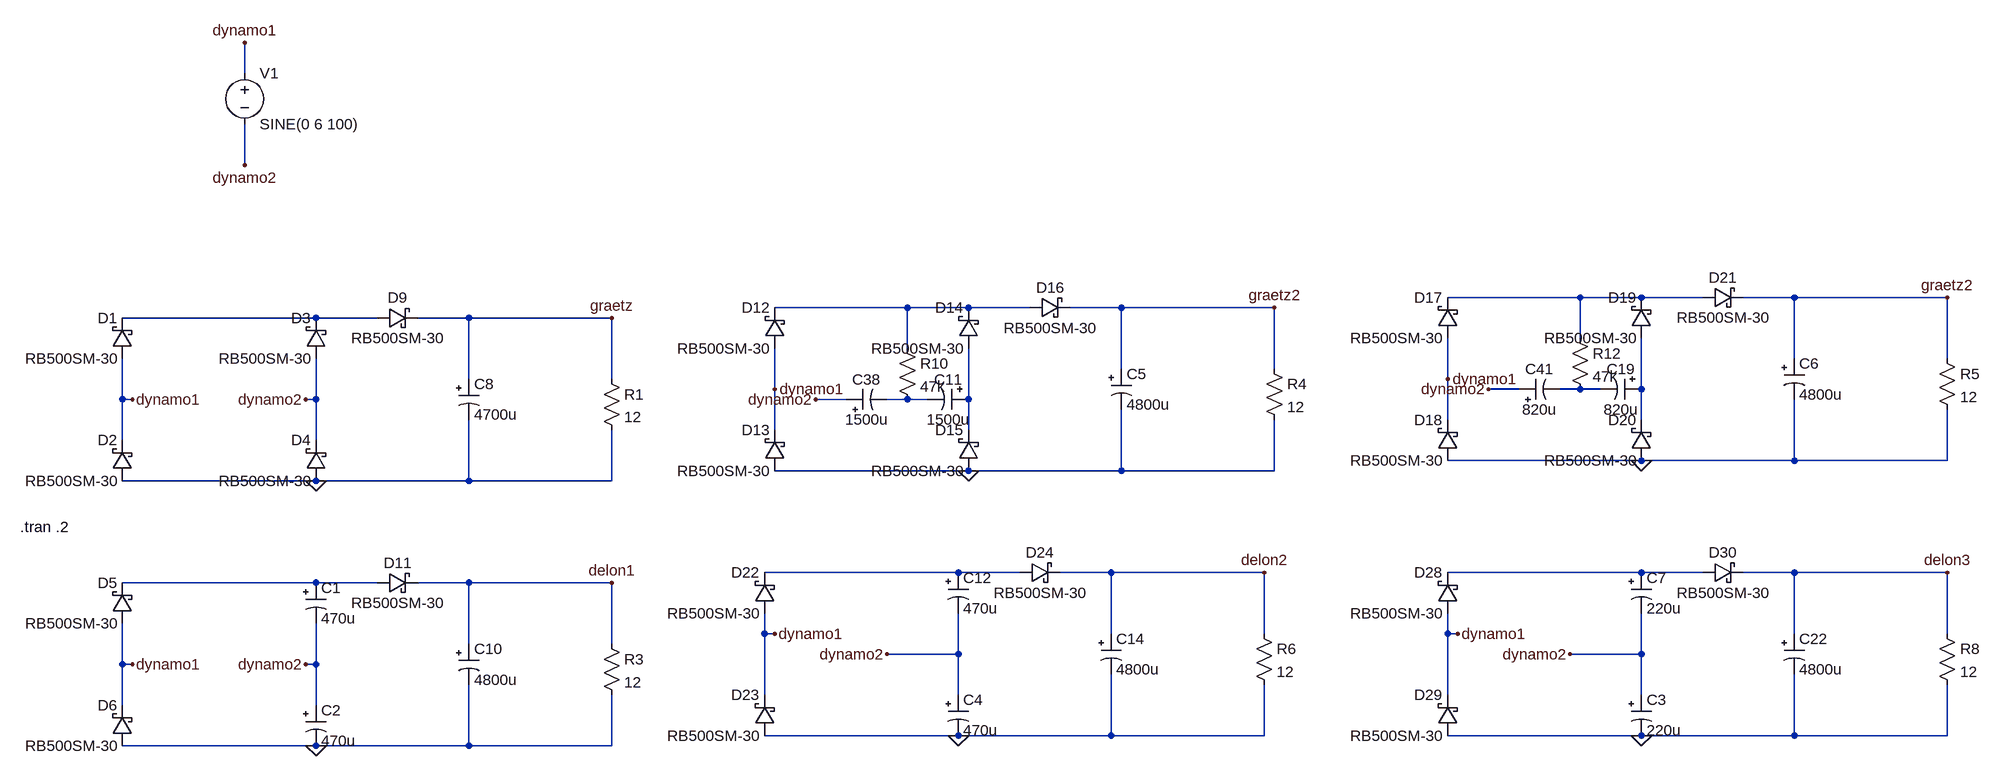
[diagram p0: schematic graetz and delon.asc]
graetz and delon.asc, the LTspice schematic file:
Version 4
SHEET 1 3412 2492
WIRE 304 576 304 528
WIRE 304 720 304 656
WIRE 2400 928 2192 928
WIRE 2496 928 2400 928
WIRE 2592 928 2496 928
WIRE 2736 928 2656 928
WIRE 2976 928 2736 928
WIRE 1344 944 1136 944
WIRE 1440 944 1344 944
WIRE 1536 944 1440 944
WIRE 1680 944 1600 944
WIRE 1920 944 1680 944
WIRE 416 960 112 960
WIRE 512 960 416 960
WIRE 656 960 576 960
WIRE 880 960 656 960
WIRE 2400 992 2400 928
WIRE 1344 1008 1344 944
WIRE 2736 1024 2736 928
WIRE 2976 1024 2976 928
WIRE 1680 1040 1680 944
WIRE 1920 1040 1920 944
WIRE 656 1056 656 960
WIRE 880 1056 880 960
WIRE 2192 1056 2192 992
WIRE 1136 1072 1136 1008
WIRE 2304 1072 2256 1072
WIRE 2400 1072 2368 1072
WIRE 2432 1072 2400 1072
WIRE 2496 1072 2496 992
WIRE 112 1088 112 1024
WIRE 128 1088 112 1088
WIRE 416 1088 416 1024
WIRE 416 1088 400 1088
WIRE 1248 1088 1200 1088
WIRE 1344 1088 1312 1088
WIRE 1376 1088 1344 1088
WIRE 1440 1088 1440 1008
WIRE 2192 1120 2192 1056
WIRE 2496 1120 2496 1072
WIRE 1136 1136 1136 1072
WIRE 1440 1136 1440 1088
WIRE 112 1152 112 1088
WIRE 416 1152 416 1088
WIRE 2496 1184 2192 1184
WIRE 2736 1184 2736 1088
WIRE 2736 1184 2496 1184
WIRE 2976 1184 2976 1104
WIRE 2976 1184 2736 1184
WIRE 1440 1200 1136 1200
WIRE 1680 1200 1680 1104
WIRE 1680 1200 1440 1200
WIRE 1920 1200 1920 1120
WIRE 1920 1200 1680 1200
WIRE 416 1216 112 1216
WIRE 656 1216 656 1120
WIRE 656 1216 416 1216
WIRE 880 1216 880 1136
WIRE 880 1216 656 1216
WIRE 1424 1360 1120 1360
WIRE 1520 1360 1424 1360
WIRE 1664 1360 1584 1360
WIRE 1904 1360 1664 1360
WIRE 2496 1360 2192 1360
WIRE 2592 1360 2496 1360
WIRE 2736 1360 2656 1360
WIRE 2976 1360 2736 1360
WIRE 416 1376 112 1376
WIRE 512 1376 416 1376
WIRE 656 1376 576 1376
WIRE 880 1376 656 1376
WIRE 1120 1456 1120 1424
WIRE 1136 1456 1120 1456
WIRE 1664 1456 1664 1360
WIRE 1904 1456 1904 1360
WIRE 2192 1456 2192 1424
WIRE 2208 1456 2192 1456
WIRE 2736 1456 2736 1360
WIRE 2976 1456 2976 1360
WIRE 656 1472 656 1376
WIRE 880 1472 880 1376
WIRE 1424 1488 1424 1424
WIRE 1424 1488 1312 1488
WIRE 2496 1488 2496 1424
WIRE 2496 1488 2384 1488
WIRE 112 1504 112 1440
WIRE 128 1504 112 1504
WIRE 416 1504 416 1440
WIRE 416 1504 400 1504
WIRE 1120 1552 1120 1456
WIRE 1424 1552 1424 1488
WIRE 2192 1552 2192 1456
WIRE 2496 1552 2496 1488
WIRE 112 1568 112 1504
WIRE 416 1568 416 1504
WIRE 1424 1616 1120 1616
WIRE 1664 1616 1664 1520
WIRE 1664 1616 1424 1616
WIRE 1904 1616 1904 1536
WIRE 1904 1616 1664 1616
WIRE 2496 1616 2192 1616
WIRE 2736 1616 2736 1520
WIRE 2736 1616 2496 1616
WIRE 2976 1616 2976 1536
WIRE 2976 1616 2736 1616
WIRE 416 1632 112 1632
WIRE 656 1632 656 1536
WIRE 656 1632 416 1632
WIRE 880 1632 880 1552
WIRE 880 1632 656 1632
FLAG 416 1216 0
FLAG 416 1632 0
FLAG 880 960 graetz
FLAG 880 1376 delon1
FLAG 1440 1200 0
FLAG 1920 944 graetz2
FLAG 1424 1616 0
FLAG 1904 1360 delon2
FLAG 2496 1616 0
FLAG 2976 1360 delon3
FLAG 304 528 dynamo1
FLAG 304 720 dynamo2
FLAG 128 1088 dynamo1
FLAG 128 1504 dynamo1
FLAG 400 1088 dynamo2
FLAG 400 1504 dynamo2
FLAG 1136 1072 dynamo1
FLAG 1136 1456 dynamo1
FLAG 2208 1456 dynamo1
FLAG 1200 1088 dynamo2
FLAG 1312 1488 dynamo2
FLAG 2384 1488 dynamo2
FLAG 2496 1184 0
FLAG 2976 928 graetz2
FLAG 2192 1056 dynamo1
FLAG 2256 1072 dynamo2
SYMBOL voltage 304 560 R0
WINDOW 123 0 0 Left 0
WINDOW 39 0 0 Left 0
SYMATTR InstName V1
SYMATTR Value SINE(0 6 100)
SYMBOL schottky 128 1024 R180
WINDOW 0 24 64 Left 2
WINDOW 3 24 0 Left 2
SYMATTR InstName D1
SYMATTR Value RB500SM-30
SYMATTR Description Diode
SYMATTR Type diode
SYMBOL schottky 128 1216 R180
WINDOW 0 24 64 Left 2
WINDOW 3 24 0 Left 2
SYMATTR InstName D2
SYMATTR Value RB500SM-30
SYMATTR Description Diode
SYMATTR Type diode
SYMBOL schottky 432 1024 R180
WINDOW 0 24 64 Left 2
WINDOW 3 24 0 Left 2
SYMATTR InstName D3
SYMATTR Value RB500SM-30
SYMATTR Description Diode
SYMATTR Type diode
SYMBOL schottky 432 1216 R180
WINDOW 0 24 64 Left 2
WINDOW 3 24 0 Left 2
SYMATTR InstName D4
SYMATTR Value RB500SM-30
SYMATTR Description Diode
SYMATTR Type diode
SYMBOL res 864 1040 R0
SYMATTR InstName R1
SYMATTR Value 12
SYMBOL schottky 128 1440 R180
WINDOW 0 24 64 Left 2
WINDOW 3 24 0 Left 2
SYMATTR InstName D5
SYMATTR Value RB500SM-30
SYMATTR Description Diode
SYMATTR Type diode
SYMBOL schottky 128 1632 R180
WINDOW 0 24 64 Left 2
WINDOW 3 24 0 Left 2
SYMATTR InstName D6
SYMATTR Value RB500SM-30
SYMATTR Description Diode
SYMATTR Type diode
SYMBOL polcap 400 1376 R0
WINDOW 3 24 56 Left 2
SYMATTR Value 470u
SYMATTR InstName C1
SYMATTR Description Capacitor
SYMATTR Type cap
SYMATTR SpiceLine V=2 Irms=3.87298 Rser=0.015 Lser=0 mfg="KEMET" pn="A700X477M002ATE015" type="Al electrolytic"
SYMBOL schottky 512 976 R270
WINDOW 0 32 32 VTop 2
WINDOW 3 0 32 VBottom 2
SYMATTR InstName D9
SYMATTR Value RB500SM-30
SYMATTR Description Diode
SYMATTR Type diode
SYMBOL polcap 640 1056 R0
WINDOW 3 24 56 Left 2
SYMATTR Value 4700u
SYMATTR InstName C8
SYMATTR Description Capacitor
SYMATTR Type cap
SYMATTR SpiceLine V=35 Irms=2.03 Rser=0.033 Lser=0 mfg="Nichicon" pn="UPR1V472MRH" type="Al electrolytic"
SYMBOL res 864 1456 R0
SYMATTR InstName R3
SYMATTR Value 12
SYMBOL schottky 512 1392 R270
WINDOW 0 32 32 VTop 2
WINDOW 3 0 32 VBottom 2
SYMATTR InstName D11
SYMATTR Value RB500SM-30
SYMATTR Description Diode
SYMATTR Type diode
SYMBOL polcap 640 1472 R0
WINDOW 3 24 56 Left 2
SYMATTR Value 4800u
SYMATTR InstName C10
SYMATTR Description Capacitor
SYMATTR Type cap
SYMATTR SpiceLine V=35 Irms=2.03 Rser=0.033 Lser=0
SYMBOL schottky 1152 1008 R180
WINDOW 0 24 64 Left 2
WINDOW 3 24 0 Left 2
SYMATTR InstName D12
SYMATTR Value RB500SM-30
SYMATTR Description Diode
SYMATTR Type diode
SYMBOL schottky 1152 1200 R180
WINDOW 0 24 64 Left 2
WINDOW 3 24 0 Left 2
SYMATTR InstName D13
SYMATTR Value RB500SM-30
SYMATTR Description Diode
SYMATTR Type diode
SYMBOL schottky 1456 1008 R180
WINDOW 0 24 64 Left 2
WINDOW 3 24 0 Left 2
SYMATTR InstName D14
SYMATTR Value RB500SM-30
SYMATTR Description Diode
SYMATTR Type diode
SYMBOL schottky 1456 1200 R180
WINDOW 0 24 64 Left 2
WINDOW 3 24 0 Left 2
SYMATTR InstName D15
SYMATTR Value RB500SM-30
SYMATTR Description Diode
SYMATTR Type diode
SYMBOL res 1904 1024 R0
SYMATTR InstName R4
SYMATTR Value 12
SYMBOL schottky 1536 960 R270
WINDOW 0 32 32 VTop 2
WINDOW 3 0 32 VBottom 2
SYMATTR InstName D16
SYMATTR Value RB500SM-30
SYMATTR Description Diode
SYMATTR Type diode
SYMBOL polcap 1664 1040 R0
WINDOW 3 24 56 Left 2
SYMATTR Value 4800u
SYMATTR InstName C5
SYMATTR Description Capacitor
SYMATTR Type cap
SYMATTR SpiceLine V=35 Irms=2.03 Rser=0.033 Lser=0
SYMBOL polcap 1440 1072 R90
WINDOW 3 32 32 VTop 2
WINDOW 0 0 32 VBottom 2
SYMATTR Value 1500u
SYMATTR InstName C11
SYMATTR Description Capacitor
SYMATTR Type cap
SYMATTR SpiceLine V=35 Irms=2.36 Rser=0.024 Lser=0 mfg="Nichicon" pn="UPL1V152MRH" type="Al electrolytic"
SYMBOL schottky 1136 1424 R180
WINDOW 0 24 64 Left 2
WINDOW 3 24 0 Left 2
SYMATTR InstName D22
SYMATTR Value RB500SM-30
SYMATTR Description Diode
SYMATTR Type diode
SYMBOL schottky 1136 1616 R180
WINDOW 0 24 64 Left 2
WINDOW 3 24 0 Left 2
SYMATTR InstName D23
SYMATTR Value RB500SM-30
SYMATTR Description Diode
SYMATTR Type diode
SYMBOL res 1888 1440 R0
SYMATTR InstName R6
SYMATTR Value 12
SYMBOL schottky 1520 1376 R270
WINDOW 0 32 32 VTop 2
WINDOW 3 0 32 VBottom 2
SYMATTR InstName D24
SYMATTR Value RB500SM-30
SYMATTR Description Diode
SYMATTR Type diode
SYMBOL polcap 1648 1456 R0
WINDOW 3 24 56 Left 2
SYMATTR Value 4800u
SYMATTR InstName C14
SYMATTR Description Capacitor
SYMATTR Type cap
SYMATTR SpiceLine V=35 Irms=2.03 Rser=0.033 Lser=0
SYMBOL schottky 2208 1424 R180
WINDOW 0 24 64 Left 2
WINDOW 3 24 0 Left 2
SYMATTR InstName D28
SYMATTR Value RB500SM-30
SYMATTR Description Diode
SYMATTR Type diode
SYMBOL schottky 2208 1616 R180
WINDOW 0 24 64 Left 2
WINDOW 3 24 0 Left 2
SYMATTR InstName D29
SYMATTR Value RB500SM-30
SYMATTR Description Diode
SYMATTR Type diode
SYMBOL res 2960 1440 R0
SYMATTR InstName R8
SYMATTR Value 12
SYMBOL schottky 2592 1376 R270
WINDOW 0 32 32 VTop 2
WINDOW 3 0 32 VBottom 2
SYMATTR InstName D30
SYMATTR Value RB500SM-30
SYMATTR Description Diode
SYMATTR Type diode
SYMBOL polcap 2720 1456 R0
WINDOW 3 24 56 Left 2
SYMATTR Value 4800u
SYMATTR InstName C22
SYMATTR Description Capacitor
SYMATTR Type cap
SYMATTR SpiceLine V=35 Irms=2.03 Rser=0.033 Lser=0
SYMBOL polcap 1248 1104 R270
WINDOW 3 0 32 VBottom 2
WINDOW 0 32 32 VTop 2
SYMATTR Value 1500u
SYMATTR InstName C38
SYMATTR Description Capacitor
SYMATTR Type cap
SYMATTR SpiceLine V=35 Irms=2.36 Rser=0.024 Lser=0 mfg="Nichicon" pn="UPL1V152MRH" type="Al electrolytic"
SYMBOL res 1328 992 R0
SYMATTR InstName R10
SYMATTR Value 47k
SYMBOL schottky 2208 992 R180
WINDOW 0 24 64 Left 2
WINDOW 3 24 0 Left 2
SYMATTR InstName D17
SYMATTR Value RB500SM-30
SYMATTR Description Diode
SYMATTR Type diode
SYMBOL schottky 2208 1184 R180
WINDOW 0 24 64 Left 2
WINDOW 3 24 0 Left 2
SYMATTR InstName D18
SYMATTR Value RB500SM-30
SYMATTR Description Diode
SYMATTR Type diode
SYMBOL schottky 2512 992 R180
WINDOW 0 24 64 Left 2
WINDOW 3 24 0 Left 2
SYMATTR InstName D19
SYMATTR Value RB500SM-30
SYMATTR Description Diode
SYMATTR Type diode
SYMBOL schottky 2512 1184 R180
WINDOW 0 24 64 Left 2
WINDOW 3 24 0 Left 2
SYMATTR InstName D20
SYMATTR Value RB500SM-30
SYMATTR Description Diode
SYMATTR Type diode
SYMBOL res 2960 1008 R0
SYMATTR InstName R5
SYMATTR Value 12
SYMBOL schottky 2592 944 R270
WINDOW 0 32 32 VTop 2
WINDOW 3 0 32 VBottom 2
SYMATTR InstName D21
SYMATTR Value RB500SM-30
SYMATTR Description Diode
SYMATTR Type diode
SYMBOL polcap 2720 1024 R0
WINDOW 3 24 56 Left 2
SYMATTR Value 4800u
SYMATTR InstName C6
SYMATTR Description Capacitor
SYMATTR Type cap
SYMATTR SpiceLine V=35 Irms=2.03 Rser=0.033 Lser=0
SYMBOL polcap 2496 1056 R90
WINDOW 3 32 32 VTop 2
WINDOW 0 0 32 VBottom 2
SYMATTR Value 820u
SYMATTR InstName C19
SYMATTR Description Capacitor
SYMATTR Type cap
SYMATTR SpiceLine V=50 Irms=2.77 Rser=0.0194738 Lser=8.84194n mfg="W�rth Elektronik" pn="860080678022 WCAP-ATLI 13x30" type="Al electrolytic"
SYMBOL polcap 2304 1088 R270
WINDOW 3 0 32 VBottom 2
WINDOW 0 32 32 VTop 2
SYMATTR Value 820u
SYMATTR InstName C41
SYMATTR Description Capacitor
SYMATTR Type cap
SYMATTR SpiceLine V=35 Irms=2.63 Rser=0.0175277 Lser=8.76511n mfg="W�rth Elektronik" pn="860080578020 WCAP-ATLI 13x25" type="Al electrolytic"
SYMBOL res 2384 976 R0
SYMATTR InstName R12
SYMATTR Value 47k
SYMBOL polcap 2480 1360 R0
WINDOW 3 24 56 Left 2
SYMATTR Value 220u
SYMATTR InstName C7
SYMATTR Description Capacitor
SYMATTR Type cap
SYMATTR SpiceLine V=2 Irms=4.08248 Rser=0.015 Lser=0 mfg="KEMET" pn="A700D227M002ATE015" type="Al electrolytic"
SYMBOL polcap 1408 1552 R0
SYMATTR InstName C4
SYMATTR Value 470u
SYMATTR Description Capacitor
SYMATTR Type cap
SYMATTR SpiceLine V=2 Irms=3.87298 Rser=0.015 Lser=0 mfg="KEMET" pn="A700X477M002ATE015" type="Al electrolytic"
SYMBOL polcap 400 1568 R0
SYMATTR InstName C2
SYMATTR Value 470u
SYMATTR Description Capacitor
SYMATTR Type cap
SYMATTR SpiceLine V=2 Irms=3.87298 Rser=0.015 Lser=0 mfg="KEMET" pn="A700X477M002ATE015" type="Al electrolytic"
SYMBOL polcap 1408 1360 R0
SYMATTR InstName C12
SYMATTR Value 470u
SYMATTR Description Capacitor
SYMATTR Type cap
SYMATTR SpiceLine V=2 Irms=3.87298 Rser=0.015 Lser=0 mfg="KEMET" pn="A700X477M002ATE015" type="Al electrolytic"
SYMBOL polcap 2480 1552 R0
SYMATTR InstName C3
SYMATTR Value 220u
SYMATTR Description Capacitor
SYMATTR Type cap
SYMATTR SpiceLine V=2 Irms=4.08248 Rser=0.015 Lser=0 mfg="KEMET" pn="A700D227M002ATE015" type="Al electrolytic"
TEXT -48 1288 Left 2 !.tran .2

The netlist it stands for:
* graetz and delon.asc
V1 dynamo1 dynamo2 SINE(0 6 100)
D1 dynamo1 N003 RB500SM-30
D2 0 dynamo1 RB500SM-30
D3 dynamo2 N003 RB500SM-30
D4 0 dynamo2 RB500SM-30
R1 graetz 0 12
D5 dynamo1 N010 RB500SM-30
D6 0 dynamo1 RB500SM-30
C1 N010 dynamo2 470u V=2 Irms=3.87298 Rser=0.015 Lser=0 mfg="KEMET" pn="A700X477M002ATE015" type="Al electrolytic"
D9 N003 graetz RB500SM-30
C8 graetz 0 4700u V=35 Irms=2.03 Rser=0.033 Lser=0 mfg="Nichicon" pn="UPR1V472MRH" type="Al electrolytic"
R3 delon1 0 12
D11 N010 delon1 RB500SM-30
C10 delon1 0 4800u V=35 Irms=2.03 Rser=0.033 Lser=0
D12 dynamo1 N002 RB500SM-30
D13 0 dynamo1 RB500SM-30
D14 N007 N002 RB500SM-30
D15 0 N007 RB500SM-30
R4 graetz2 0 12
D16 N002 graetz2 RB500SM-30
C5 graetz2 0 4800u V=35 Irms=2.03 Rser=0.033 Lser=0
C11 N007 N006 1500u V=35 Irms=2.36 Rser=0.024 Lser=0 mfg="Nichicon" pn="UPL1V152MRH" type="Al electrolytic"
D22 dynamo1 N008 RB500SM-30
D23 0 dynamo1 RB500SM-30
R6 delon2 0 12
D24 N008 delon2 RB500SM-30
C14 delon2 0 4800u V=35 Irms=2.03 Rser=0.033 Lser=0
D28 dynamo1 N009 RB500SM-30
D29 0 dynamo1 RB500SM-30
R8 delon3 0 12
D30 N009 delon3 RB500SM-30
C22 delon3 0 4800u V=35 Irms=2.03 Rser=0.033 Lser=0
C38 dynamo2 N006 1500u V=35 Irms=2.36 Rser=0.024 Lser=0 mfg="Nichicon" pn="UPL1V152MRH" type="Al electrolytic"
R10 N002 N006 47k
D17 dynamo1 N001 RB500SM-30
D18 0 dynamo1 RB500SM-30
D19 N005 N001 RB500SM-30
D20 0 N005 RB500SM-30
R5 graetz2 0 12
D21 N001 graetz2 RB500SM-30
C6 graetz2 0 4800u V=35 Irms=2.03 Rser=0.033 Lser=0
C19 N005 N004 820u V=50 Irms=2.77 Rser=0.0194738 Lser=8.84194n mfg="W�rth Elektronik" pn="860080678022 WCAP-ATLI 13x30" type="Al electrolytic"
C41 dynamo2 N004 820u V=35 Irms=2.63 Rser=0.0175277 Lser=8.76511n mfg="W�rth Elektronik" pn="860080578020 WCAP-ATLI 13x25" type="Al electrolytic"
R12 N001 N004 47k
C7 N009 dynamo2 220u V=2 Irms=4.08248 Rser=0.015 Lser=0 mfg="KEMET" pn="A700D227M002ATE015" type="Al electrolytic"
C4 dynamo2 0 470u V=2 Irms=3.87298 Rser=0.015 Lser=0 mfg="KEMET" pn="A700X477M002ATE015" type="Al electrolytic"
C2 dynamo2 0 470u V=2 Irms=3.87298 Rser=0.015 Lser=0 mfg="KEMET" pn="A700X477M002ATE015" type="Al electrolytic"
C12 N008 dynamo2 470u V=2 Irms=3.87298 Rser=0.015 Lser=0 mfg="KEMET" pn="A700X477M002ATE015" type="Al electrolytic"
C3 dynamo2 0 220u V=2 Irms=4.08248 Rser=0.015 Lser=0 mfg="KEMET" pn="A700D227M002ATE015" type="Al electrolytic"
.model D D
.lib standard.dio
.tran .2
.backanno
.end